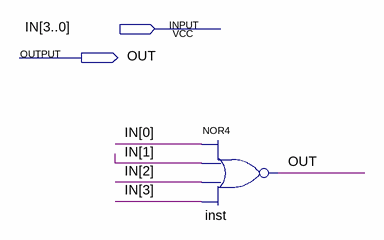
[diagram p0: schematic sheet]
// Quartus schematic FLAG_ZERO.bdf as structural Verilog: 1 symbols, 2 pins
module FLAG_ZERO (
  input  [3:0] IN,
  output OUT
);

  nor inst (OUT, IN[0], IN[1], IN[2], IN[3]);
endmodule
